# Altium schematic sheet filter_circuit_final.SchDoc
size A4
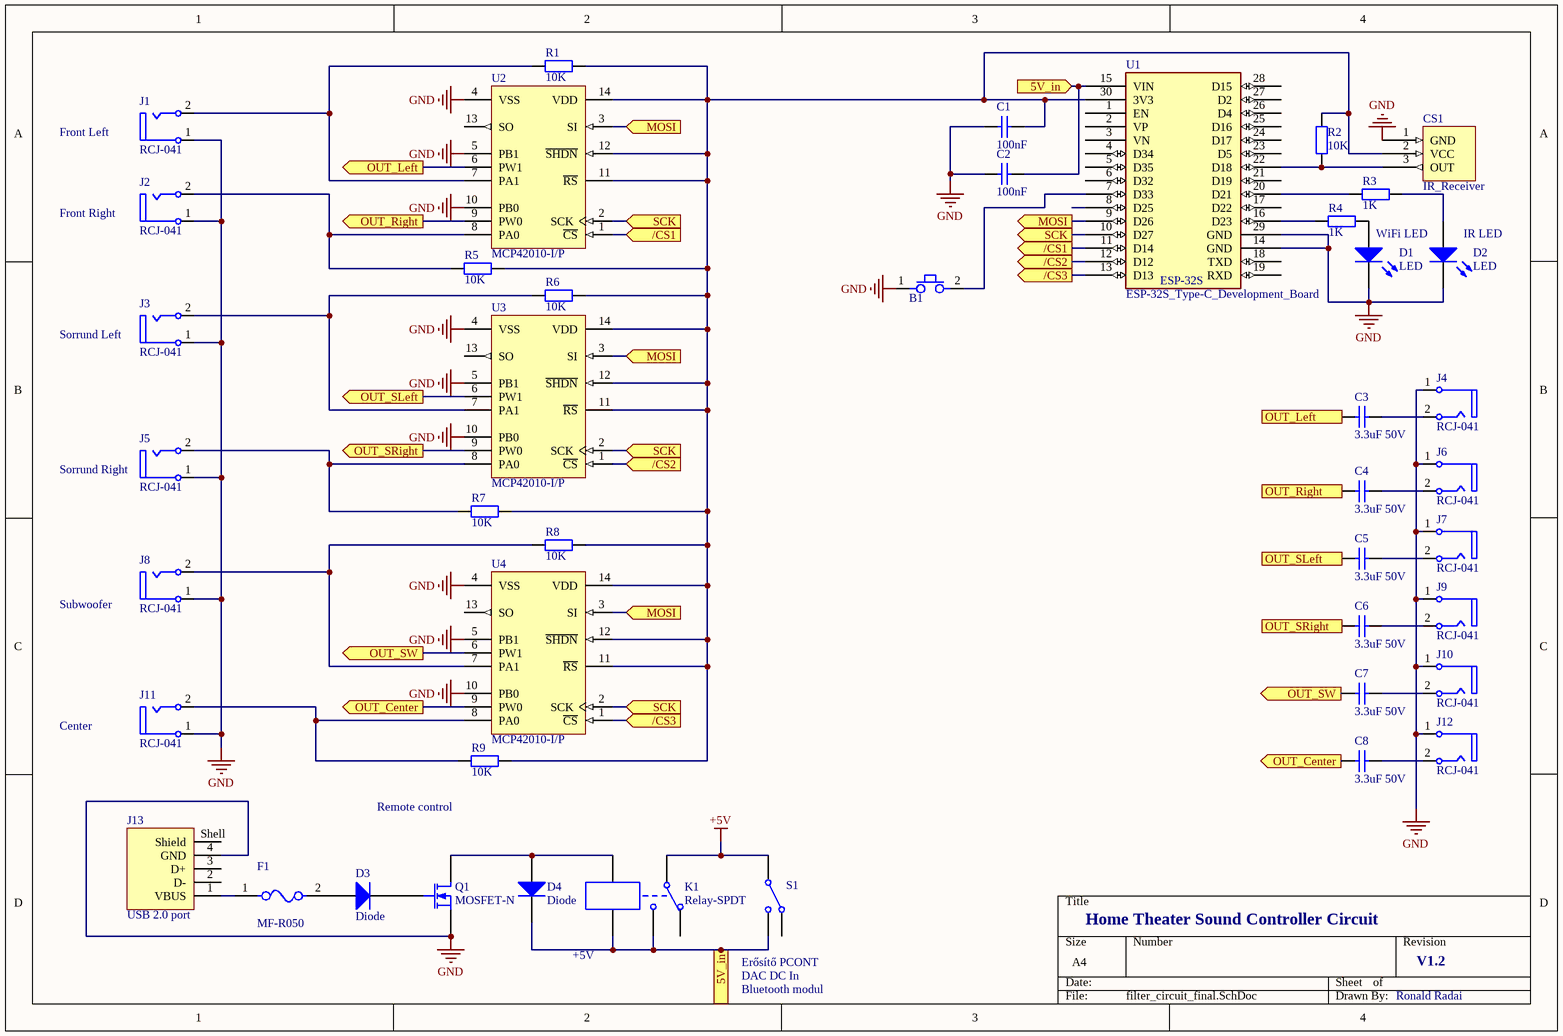
[diagram p0: filter_circuit_final.SchDoc]

## Parts
B1  Button  [FP_BTN_SMD_3x6]  (value not drawn)
C1  100nF  [FP_0805_CAP_085]
C2  100nF  [FP_0805_CAP_085]
C3  3.3uF 50V  [FP_0805_CAP_085]
C4  3.3uF 50V  [FP_0805_CAP_085]
C5  3.3uF 50V  [FP_0805_CAP_085]
C6  3.3uF 50V  [FP_0805_CAP_085]
C7  3.3uF 50V  [FP_0805_CAP_085]
C8  3.3uF 50V  [FP_0805_CAP_085]
CS1  IR_Receiver
D1  LED  [FP_0805_LED_RED]
D2  LED  [FP_0805_LED_RED]
D3  Diode  [SMC]
D4  Diode  [SMC]
F1  MF-R050  [FP-MF-R050-MFG]
J1  RCJ-041  [CUI-RCJ-041_V]
J2  RCJ-041  [CUI-RCJ-041_V]
J3  RCJ-041  [CUI-RCJ-041_V]
J4  RCJ-041  [CUI-RCJ-041_V]
J5  RCJ-041  [CUI-RCJ-041_V]
J6  RCJ-041  [CUI-RCJ-041_V]
J7  RCJ-041  [CUI-RCJ-041_V]
J8  RCJ-041  [CUI-RCJ-041_V]
J9  RCJ-041  [CUI-RCJ-041_V]
J10  RCJ-041  [CUI-RCJ-041_V]
J11  RCJ-041  [CUI-RCJ-041_V]
J12  RCJ-041  [CUI-RCJ-041_V]
J13  USB 2.0 port  [629104151021]
K1  Relay-SPDT  [MODULE5B]
Q1  MOSFET-N  [E3]
R1  10K  [FP_0805_RES]
R2  10K  [FP_0805_RES]
R3  1K  [FP_0805_RES]
R4  1K  [FP_0805_RES]
R5  10K  [FP_0805_RES]
R6  10K  [FP_0805_RES]
R7  10K  [FP_0805_RES]
R8  10K  [FP_0805_RES]
R9  10K  [FP_0805_RES]
S1  Single-Pole, Double-Throw Switch  (value not drawn)
U1  ESP-32S_Type-C_Development_Board  [FP-ESP32-C3-DevKitC-02-MFG]
U2  MCP42010-I/P  [PDIP300-P14]
U3  MCP42010-I/P  [PDIP300-P14]
U4  MCP42010-I/P  [PDIP300-P14]

## Ports
5V_in (in), 5V_in (out), /CS1 (in), /CS1 (out), /CS2 (in), /CS2 (out), /CS3 (in), /CS3 (out), MOSI (in), MOSI (out), OUT_Center (out), OUT_Left (out), OUT_Right (out), OUT_SLeft (out), OUT_SRight (out), OUT_SW (out), SCK (in), SCK (out)

## Nets
+5V: K1.1 S1.1
GND: B1.1 C1.2 C2.2 CS1.1(GND) D1.2(K) D2.2(K) J1.1 J2.1 J3.1 J4.1 J5.1 J6.1 J7.1 J8.1 J9.1 J10.1 J11.1 J12.1 J13.4(GND) Q1.3(S) U1.14(GND) U1.29(GND) U2.4(VSS) U2.5(PB1) U2.10(PB0) U3.4(VSS) U3.5(PB1) U3.10(PB0) U4.4(VSS) U4.5(PB1) U4.10(PB0)
5V_in: C2.1 D4.2(K) K1.3 K1.5 S1.2 U1.15(VIN) ; port 5V_in
/CS1: U1.11(D14) U2.1(~{CS}) ; port /CS1
/CS2: U1.12(D12) U3.1(~{CS}) ; port /CS2
/CS3: U1.13(D13) U4.1(~{CS}) ; port /CS3
MOSI: U1.9(D26) U2.3(SI) U3.3(SI) U4.3(SI) ; port MOSI
OUT_Center: C8.1 U4.9(PW0) ; port OUT_Center
OUT_Left: C3.1 U2.6(PW1) ; port OUT_Left
OUT_Right: C4.1 U2.9(PW0) ; port OUT_Right
OUT_SLeft: C5.1 U3.6(PW1) ; port OUT_SLeft
OUT_SRight: C6.1 U3.9(PW0) ; port OUT_SRight
OUT_SW: C7.1 U4.6(PW1) ; port OUT_SW
SCK: U1.10(D27) U2.2(SCK) U3.2(SCK) U4.2(SCK) ; port SCK
NetB1_2: B1.2 U1.7(D33)
NetC1_1: C1.1 CS1.2(VCC) R1.2 R2.2 R5.2 R6.2 R7.2 R8.2 R9.2 U1.30(3V3) U2.11(~{RS}) U2.12(~{SHDN}) U2.14(VDD) U3.11(~{RS}) U3.12(~{SHDN}) U3.14(VDD) U4.11(~{RS}) U4.12(~{SHDN}) U4.14(VDD)
NetC3_2: C3.2 J4.2
NetC4_2: C4.2 J6.2
NetC5_2: C5.2 J7.2
NetC6_2: C6.2 J9.2
NetC7_2: C7.2 J10.2
NetC8_2: C8.2 J12.2
NetCS1_3: CS1.3(OUT) R2.1 U1.22(D18)
NetD1_1: D1.1(A) R4.1
NetD2_1: D2.1(A) R3.2
NetD3_1: D3.1(A) F1.2
NetD3_2: D3.2(K) Q1.2(G)
NetD4_1: D4.1(A) K1.4 Q1.1(D)
NetF1_1: F1.1 J13.1(VBUS)
NetJ1_2: J1.2 R1.1 U2.7(PA1)
NetJ2_2: J2.2 R5.1 U2.8(PA0)
NetJ3_2: J3.2 R6.1 U3.7(PA1)
NetJ5_2: J5.2 R7.1 U3.8(PA0)
NetJ8_2: J8.2 R8.1 U4.7(PA1)
NetJ11_2: J11.2 R9.1 U4.8(PA0)
NetR3_1: R3.1 U1.20(D21)
NetR4_2: R4.2 U1.16(D23)

Not connected (* = marked no-connect by the designer): J13 2(D-) 3(D+) Shell(Shield); K1 2; S1 3; U1 1(EN) 2(VP) 3(VN) 4(D34) 5(D35) 6(D32) 8(D25) 17(D22) 18(TXD) 19(RXD) 21(D19) 23(D5) 24(D17) 25(D16) 26(D4) 27(D2) 28(D15); U2 13(SO); U3 13(SO); U4 13(SO)

## Notes on the sheet
- Front Left
- Front Right
- (near D1) WiFi LED
- (near D2) IR LED
- (near J3) Sorrund Left
- (near J5) Sorrund Right
- Subwoofer
- Center
- (near R9) Remote control
- Home Theater Sound Controller Circuit
- +5V
- (near S1) Erősítő PCONT
- DAC DC In
- V1.2
- Bluetooth modul
- Ronald Radai
- (in symbol ESP-32S_TypeC_DevKit) ESP-32S

## Library data of the parts
B1 = Button 2P: Push button
C1-C8 = CAP: Capacitor
  C1 C2: Value: 100nF
  C3-C8: Value: 3.3uF 50V
D1 D2 = LED: Typical RED GaAs LED; pin to pad: 1>A 2>K
D3 D4 = Diode: Default Diode; Published: 8-Jun-2000; LatestRevisionDate: 17-Jul-2002; LatestRevisionNote: Re-released for DXP Platform.; PackageVersion: Sep-1996; PackageReference: SMC; Publisher: Altium Limited; PackageDescription: DO-214-AB/SMC; 2 C-Bend Leads; Body 7.9 x 5.9 mm, inc. leads (LxW); Code_JEDEC: DO-214-AB
F1 = CMP-07400-000037-1: PTC RESET FUSE 60V 500MA RADIAL; Manufacturer: Bourns; Current Rating: 40A; Trip Time: 4s; Resistance: 0.41-0.77Ω; Value: 0.41-0.77Ω; Trip Current: 1A; Hold Current: 0.5A; Automotive: No; Device Class L1: Circuit Protection; Ambient Temperature Range Low: -40°C; Height: 13.7mm; Category: Fuse; ComponentLink2Description: Datasheet; Device Class L3: unset; Mouser Description: PTC Resettable Fuse 0.5A(hold) 1A(trip) 60V 40A 0.75W 4s 0.41Ohm Radial 7.9 X 3.1mm Bulk; RoHS: TRUE; Temperature Range High: +85°C; Octopart: https://octopart.com/mf-r050-bourns-19418; Temperature Range Low: -40°C; Device Class L2: PTC Resettable Fuses; Package: MF-R050; Manufacturer Part Number: MF-R050; Temperature: -40°C to +85°C; Ambient Temperature Range High: +85°C; ComponentLink2URL: https://upverter.com/datasheet/a1b715b2a3574ae967878e49fe70c2811aecae4b.pdf; Digikey Description: PTC RESET FUSE 60V 500MA RADIAL; Lead Free: Yes; Voltage Rating: 60V
J1-J12 = CMP-1692-00002-1: Female RCJ Jack, 2 Position, Height 11.724 mm, Tail Length 4 mm, RoHS, Bulk; Case\Package: Metal; Connector Type: HDMI; Current Rating: 500 mA; Voltage Rating: 40 V; Length: 16.2 mm; Pins: 19; ComponentLink1URL: http://www.cui.com/; ComponentLink1Description: Manufacturer URL; Packaging: Tape and Reel; Lead Pitch: 0.5 mm; PackageDescription: Female RCJ Jack, 2 Position, Height 11.724 mm, Tail Length 4 mm; RoHSCompliant: true; Min Operating Temperature: -55 degC; Height: 6.1 mm; Contact Material: Copper; REACH SVHC: No SVHC; DatasheetVersion: Rev. B, 02/2012; ComponentLink2Description: Datasheet; Contact Plating: Gold; Colour: Black; Max Operating Temperature: 85 degC; Mount: Surface Mount; Package Quantity: 400; Gender: Female; ComponentLink2URL: http://www.cui.com/product/resource/rcj-04x.pdf; PackageReference: RCJ-041
J13 = CMP-1502-03241-3: NexarPartId: 52645112; USB Standard: USB 2.0; Insulation Resistance: 1GΩ; Current Rating: 1.5A; Number of Contacts: 4; Contact Resistance: 30mΩ; Gender: Receptacle; Operating Supply Voltage: 30V; Mount: Horizontal, Surface Mount; RoHS: Compliant; Max Operating Temperature: 85°C; Min Operating Temperature: -40°C; Contact Plating: Gold; Contact Material: Gold, Nickel; Number of Pins: 4; Packaging: Tape and Reel; Connector Type: USB; Height: 7.2mm; Orientation: Horizontal; Voltage Rating: 30V; Termination: SMD/SMT; Features: Shielded; REACH SVHC: Unknown
K1 = Relay-SPDT: Single-Pole Dual-Throw Relay; Published: 24-Mar-1999; LatestRevisionDate: 17-Jul-2002; LatestRevisionNote: Re-released for DXP Platform.; PackageReference: MODULE5B; Publisher: Altium Limited
Q1 = MOSFET-N: N-Channel MOSFET; Published: 8-Jun-2000; LatestRevisionDate: 17-Jul-2002; LatestRevisionNote: Re-released for DXP Platform.; PackageVersion: 1995/1996; PackageReference: E3; Publisher: Altium Limited; PackageDescription: TO, Flat Index; 3 In-Line, Axial Leads; Body Dia. 4.6mm; Lead Dia. 0.5 mm (max)
R1-R9 = RES: Resistor
  R1 R2 R5-R9: Value: 10K
  R3 R4: Value: 1K
S1 = SPDT SW: nodeUP_closed: 1; Rclosed: 1m; Ropen: 1Meg; SimulationGenericComponent: True
U1 = ESP-32S_TypeC_DevKit
U2-U4 = CMP-0188-00252-2: Single/Dual Digital Potentiometer with SPI Interface, 14-Pin PDIP, Industrial Temperature; PackageVersion: revBB, Aug-2009; ComponentLink1URL: http://www.microchip.com/; ComponentLink3Description: Package Specification; DatasheetVersion: Jul-2003; PackageReference: PDIP300-P14; PackageDescription: 14-Lead Plastic Dual In-Line (P) - 300 mil Body [PDIP]; ComponentLink1Description: Manufacturer URL; ComponentLink3URL: http://www.microchip.com/stellent/groups/techpub_sg/documents/packagingspec/en012702.pdf; ComponentLink2Description: Datasheet; RevisionNote: URLs added.; ComponentLink2URL: http://ww1.microchip.com/downloads/en/DeviceDoc/11195c.pdf